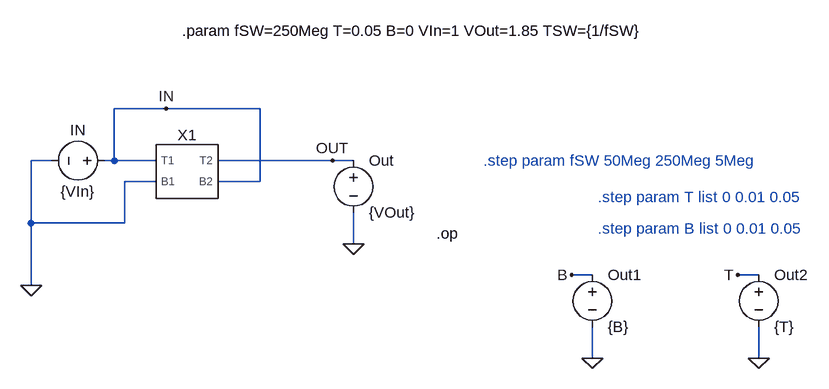
[diagram p0: schematic 4Term_Model_EQ_TB.asc]
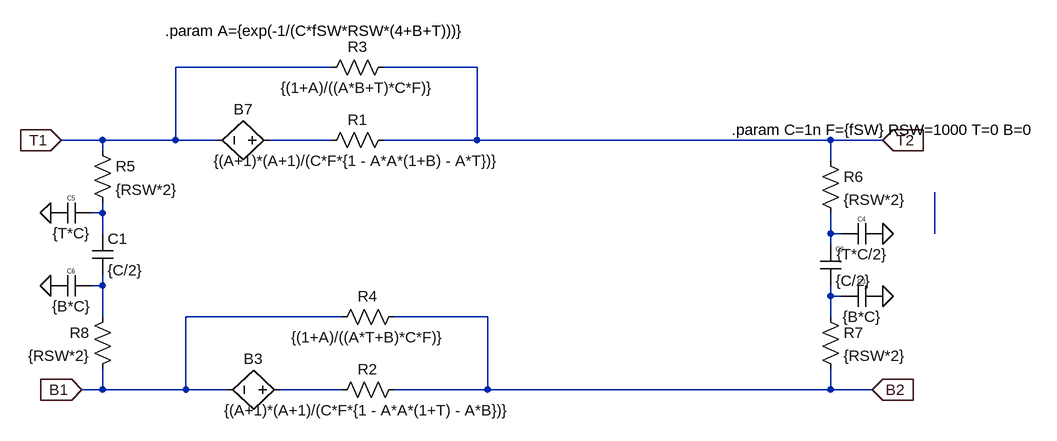
[diagram p1: sub-circuit 4term_model_eq.asc]
4Term_Model_EQ_TB.asc, the LTspice schematic file:
Version 4
SHEET 1 1136 680
WIRE 128 -32 48 -32
WIRE 272 -32 128 -32
WIRE -48 48 -80 48
WIRE 48 48 48 -32
WIRE 48 48 32 48
WIRE 112 48 48 48
WIRE 384 48 208 48
WIRE 416 48 384 48
WIRE 112 80 64 80
WIRE 272 80 272 -32
WIRE 272 80 208 80
WIRE -80 144 -80 48
WIRE 64 144 64 80
WIRE 64 144 -80 144
WIRE 416 176 416 128
WIRE 784 224 752 224
WIRE 1040 224 1008 224
WIRE -80 240 -80 144
WIRE 784 352 784 304
WIRE 1040 352 1040 304
FLAG -80 240 0
FLAG 384 48 OUT
FLAG 416 176 0
FLAG 128 -32 IN
FLAG 752 224 B
FLAG 784 352 0
FLAG 1008 224 T
FLAG 1040 352 0
SYMBOL voltage 48 48 R90
WINDOW 0 -32 56 VBottom 2
WINDOW 3 32 56 VTop 2
SYMATTR InstName IN
SYMATTR Value {VIn}
SYMBOL voltage 416 32 R0
SYMATTR InstName Out
SYMATTR Value {VOut}
SYMBOL voltage 784 208 R0
SYMATTR InstName Out1
SYMATTR Value {B}
SYMBOL voltage 1040 208 R0
SYMATTR InstName Out2
SYMATTR Value {T}
SYMBOL 4term_model_EQ 144 96 R0
SYMATTR InstName X1
SYMATTR SpiceLine T={T}, B={B}, RSW={1}, C={1n}, fSW={fSW}
TEXT 152 -152 Left 2 !.param fSW=250Meg T=0.05 B=0 VIn=1 VOut=1.85 TSW={1/fSW}
TEXT 616 48 Left 2 ;.step param fSW 50Meg 250Meg 5Meg
TEXT 544 160 Left 2 !.op
TEXT 792 152 Left 2 ;.step param B list 0 0.01 0.05
TEXT 792 104 Left 2 ;.step param T list 0 0.01 0.05

4term_model_eq.asc, the sub-circuit schematic file:
Version 4
SHEET 1 2172 680
WIRE 912 -416 672 -416
WIRE 1136 -416 992 -416
WIRE 560 -304 496 -304
WIRE 672 -304 672 -416
WIRE 672 -304 560 -304
WIRE 736 -304 672 -304
WIRE 912 -304 816 -304
WIRE 1136 -304 1136 -416
WIRE 1136 -304 992 -304
WIRE 1680 -304 1136 -304
WIRE 1760 -304 1680 -304
WIRE 560 -288 560 -304
WIRE 1680 -272 1680 -304
WIRE 560 -192 560 -208
WIRE 560 -192 544 -192
WIRE 560 -160 560 -192
WIRE 1680 -160 1680 -192
WIRE 1696 -160 1680 -160
WIRE 1840 -160 1840 -224
WIRE 1680 -144 1680 -160
WIRE 560 -80 560 -96
WIRE 560 -80 544 -80
WIRE 1680 -64 1680 -80
WIRE 1696 -64 1680 -64
WIRE 560 -32 560 -80
WIRE 928 -32 688 -32
WIRE 1152 -32 1008 -32
WIRE 1680 -32 1680 -64
WIRE 560 80 560 48
WIRE 560 80 528 80
WIRE 688 80 688 -32
WIRE 688 80 560 80
WIRE 752 80 688 80
WIRE 928 80 832 80
WIRE 1152 80 1152 -32
WIRE 1152 80 1008 80
WIRE 1680 80 1680 48
WIRE 1680 80 1152 80
WIRE 1744 80 1680 80
FLAG 528 80 B1
IOPIN 528 80 In
FLAG 1744 80 B2
IOPIN 1744 80 In
FLAG 496 -304 T1
IOPIN 496 -304 In
FLAG 1760 -304 T2
IOPIN 1760 -304 In
FLAG 1760 -160 0
FLAG 1760 -64 0
FLAG 480 -192 0
FLAG 480 -80 0
SYMBOL bv 848 80 R90
WINDOW 0 -32 56 VBottom 2
WINDOW 3 32 56 Invisible 2
SYMATTR InstName B3
SYMATTR Value V=(V(T2) - V(T1))
SYMBOL res 1008 -320 R90
WINDOW 0 0 56 VBottom 2
WINDOW 3 32 56 VTop 2
SYMATTR InstName R1
SYMATTR Value {(A+1)*(A+1)/(C*F*{1 - A*A*(1+B) - A*T})}
SYMBOL bv 832 -304 R90
WINDOW 0 -32 56 VBottom 2
WINDOW 3 32 56 Invisible 2
SYMATTR InstName B7
SYMATTR Value V=(V(B2) - V(B1))
SYMBOL res 1008 -432 R90
WINDOW 0 0 56 VBottom 2
WINDOW 3 32 56 VTop 2
SYMATTR InstName R3
SYMATTR Value {(1+A)/((A*B+T)*C*F)}
SYMBOL res 1024 -48 R90
WINDOW 0 0 56 VBottom 2
WINDOW 3 32 56 VTop 2
SYMATTR InstName R4
SYMATTR Value {(1+A)/((A*T+B)*C*F)}
SYMBOL res 1024 64 R90
WINDOW 0 0 56 VBottom 2
WINDOW 3 32 56 VTop 2
SYMATTR InstName R2
SYMATTR Value {(A+1)*(A+1)/(C*F*{1 - A*A*(1+T) - A*B})}
SYMBOL res 1664 -288 R0
SYMATTR InstName R6
SYMATTR Value {RSW*2}
SYMBOL cap 544 -160 R0
SYMATTR InstName C1
SYMATTR Value {C/2}
SYMBOL cap 1664 -144 R0
WINDOW 0 24 8 Left 0
SYMATTR InstName C2
SYMATTR Value {C/2}
SYMBOL cap 1760 -80 R90
WINDOW 0 0 32 VBottom 0
WINDOW 3 32 32 VTop 2
SYMATTR InstName C3
SYMATTR Value {B*C}
SYMBOL cap 1760 -176 R90
WINDOW 0 0 32 VBottom 0
WINDOW 3 32 32 VTop 2
SYMATTR InstName C4
SYMATTR Value {T*C/2}
SYMBOL res 1664 -48 R0
SYMATTR InstName R7
SYMATTR Value {RSW*2}
SYMBOL res 544 -304 R0
SYMATTR InstName R5
SYMATTR Value {RSW*2}
SYMBOL res 576 -48 M0
SYMATTR InstName R8
SYMATTR Value {RSW*2}
SYMBOL cap 480 -208 M90
WINDOW 0 0 32 VBottom 0
WINDOW 3 32 32 VTop 2
SYMATTR InstName C5
SYMATTR Value {T*C}
SYMBOL cap 480 -96 M90
WINDOW 0 0 32 VBottom 0
WINDOW 3 32 32 VTop 2
SYMATTR InstName C6
SYMATTR Value {B*C}
TEXT 656 -472 Left 2 !.param A={exp(-1/(C*fSW*RSW*(4+B+T)))}
TEXT 1528 -320 Left 2 !.param C=1n F={fSW} RSW=1000 T=0 B=0

The netlist it stands for:
* 4Term_Model_EQ_TB.asc
V§IN IN 0 {VIn}
V§Out OUT 0 {VOut}
V§Out1 B 0 {B}
V§Out2 T 0 {T}
XX1 0 IN IN OUT 4term_model_eq params: T={T}, B={B}, RSW={1}, C={1n}, fSW={fSW}

* block symbol definitions
.subckt 4term_model_eq B1 B2 T1 T2
B3 N007 B1 V=(V(T2) - V(T1))
R1 T2 N001 {(A+1)*(A+1)/(C*F*{1 - A*A*(1+B) - A*T})}
B7 N001 T1 V=(V(B2) - V(B1))
R3 T2 T1 {(1+A)/((A*B+T)*C*F)}
R4 B2 B1 {(1+A)/((A*T+B)*C*F)}
R2 B2 N007 {(A+1)*(A+1)/(C*F*{1 - A*A*(1+T) - A*B})}
R6 T2 N003 {RSW*2}
C1 N002 N005 {C/2}
C2 N003 N006 {C/2}
C3 0 N006 {B*C}
C4 0 N003 {T*C/2}
R7 N006 B2 {RSW*2}
R5 T1 N002 {RSW*2}
R8 N005 B1 {RSW*2}
C5 0 N002 {T*C}
C6 0 N005 {B*C}
.param A={exp(-1/(C*fSW*RSW*(4+B+T)))}
.param C=1n F={fSW} RSW=1000 T=0 B=0
.ends 4term_model_eq

.param fSW=250Meg T=0.05 B=0 VIn=1 VOut=1.85 TSW={1/fSW}
* .step param fSW 50Meg 250Meg 5Meg
.op
* .step param B list 0 0.01 0.05
* .step param T list 0 0.01 0.05
.backanno
.end

* Results of the author's LTspice run, read from the files saved beside the schematic
* Operating Point:
*   V(in) = 1 V
*   V(out) = 1.85 V
*   V(b) = 0 V
*   V(t) = 50 mV
*   I(Out2) = 0 A
*   I(Out1) = 0 A
*   I(Out) = 9.034 mA
*   I(In) = -29.44 mA
*   Ix(x1:B1) = -20.4 mA
*   Ix(x1:B2) = 20.4 mA
*   Ix(x1:T1) = 9.034 mA
*   Ix(x1:T2) = -9.034 mA